# Altium project Carrier-Board-v1.0.PrjPcb (part 13 of 15)

## Sheet WIEGAND_INTERFACE.SchDoc
size A4; SheetNumber: 21; SheetTotal: 27
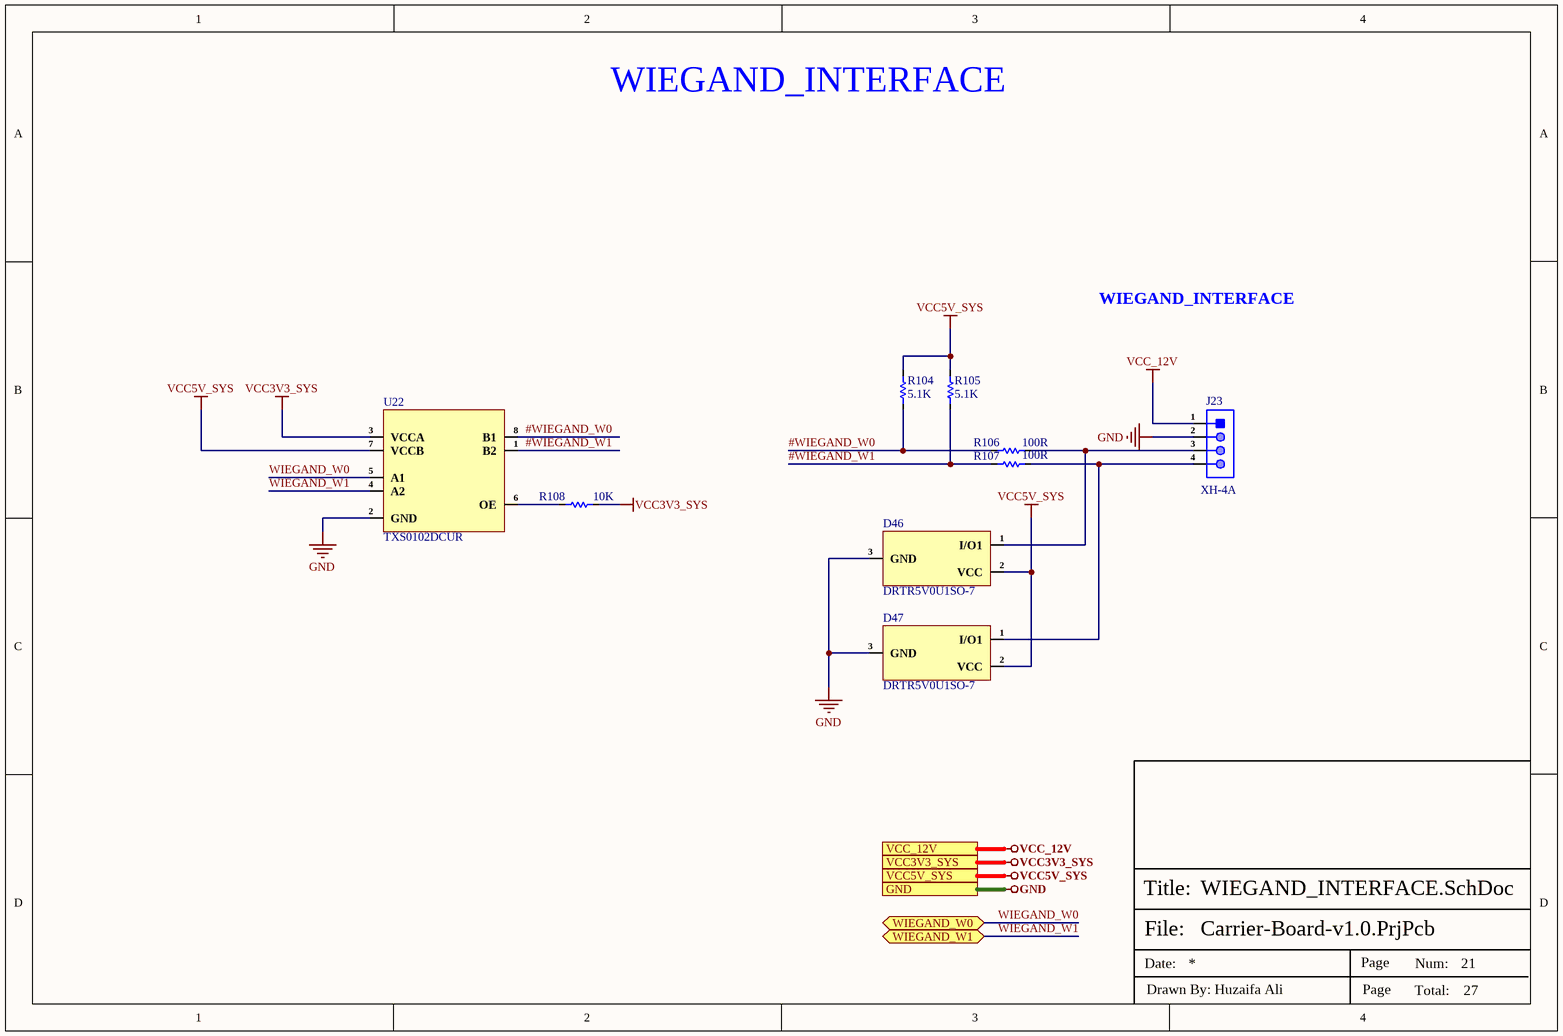
[diagram p20: WIEGAND_INTERFACE.SchDoc]

### Parts
D46  DRTR5V0U1SO-7  [SOT-23]
D47  DRTR5V0U1SO-7  [SOT-23]
J23  XH-4A  [XH-4A]
R104  5.1K  [Res-0402]
R105  5.1K  [Res-0402]
R106  100R  [Res-0402]
R107  100R  [Res-0402]
R108  10K  [Res-0402]
U22  TXS0102DCUR  [VSSOP-8(3.1x2.1)]

### Ports
GND (see TOP SHEET[3D], AUDIO_INTERFACE[1D], BUCK REGULATOR[3D], DEBUG_UART_INTERFACE[3D], DIGITAL IO_RELAY_SHEET[5D], DUAL_SIM_INTERFACE[3D], ETHERNET_PHY0[4D], ETHERNET_PHY1[4D], GSM_INTERFACE[2D], HDMI_INTERFACE[3D], INPUT_PROTECTION[3D], LINEAR_VOLTAGE_REG[3D], MICRO_SD_INTERFACE[3D], MIPI-DSI DISPLAY[3D], POWER SECTION[3D], PUSH BUTTONs_INTERFACE[3C], RGB_LEDs_INTERFACE[3D], ROCKCHIP_PWR_SUPPLY[1D], ROCKCHIP_SYSTEM_CONTROL[3C], RS232_RS485_INTERFACE[3C], SENSOR_SHEET[3D], USB2.0_INTERFACE[3D], USB3.0_INTERFACE[3D], USB-C_INTERFACE[2D], WIFI_BLUETOOTH_SHEET[4C]), VCC3V3_SYS (see TOP SHEET[3D], AUDIO_INTERFACE[1D], BUCK REGULATOR[3D], DEBUG_UART_INTERFACE[3D], DIGITAL IO_RELAY_SHEET[5D], ETHERNET_PHY0[4D], ETHERNET_PHY1[4D], GSM_INTERFACE[2D], HDMI_INTERFACE[3D], LINEAR_VOLTAGE_REG[3D], MIPI-DSI DISPLAY[3D], POWER SECTION[3D], PUSH BUTTONs_INTERFACE[3C], ROCKCHIP_PWR_SUPPLY[1D], ROCKCHIP_SYSTEM_CONTROL[3C], RS232_RS485_INTERFACE[3C], SENSOR_SHEET[3D], USB-C_INTERFACE[2D], WIFI_BLUETOOTH_SHEET[4C]), VCC5V_SYS (see TOP SHEET[3D], BUCK REGULATOR[3D], DIGITAL IO_RELAY_SHEET[5D], HDMI_INTERFACE[3D], LINEAR_VOLTAGE_REG[3D], MIPI-DSI DISPLAY[3D], POWER SECTION[3D], RGB_LEDs_INTERFACE[3D], ROCKCHIP_PWR_SUPPLY[1D], USB2.0_INTERFACE[3D], USB3.0_INTERFACE[3D], USB-C_INTERFACE[2D]), VCC_12V (see TOP SHEET[3D], AUDIO_INTERFACE[1D], BUCK REGULATOR[3D], INPUT_PROTECTION[3D], POWER SECTION[3D], PUSH BUTTONs_INTERFACE[3C]), WIEGAND_W0 (bidir, see TOP SHEET[3D], ROCKCHIP_GPIO_NC PINS[2D]), WIEGAND_W1 (bidir, see TOP SHEET[3D], ROCKCHIP_GPIO_NC PINS[2D])

### Nets
GND: D46.3(GND) D47.3(GND) J23.2 U22.2(GND) ; port GND
VCC3V3_SYS: R108.2 U22.3(VCCA) ; port VCC3V3_SYS
VCC5V_SYS: D46.2(VCC) D47.2(VCC) R104.2 R105.2 U22.7(VCCB) ; port VCC5V_SYS
VCC_12V: J23.1 ; port VCC_12V
#WIEGAND_W0: R104.1 R106.1 U22.8(B1)
#WIEGAND_W1: R105.1 R107.1 U22.1(B2)
WIEGAND_W0: U22.5(A1) ; port WIEGAND_W0
WIEGAND_W1: U22.4(A2) ; port WIEGAND_W1
NetD46_1: D46.1(I/O1) J23.3 R106.2
NetD47_1: D47.1(I/O1) J23.4 R107.2
NetR108_1: R108.1 U22.6(OE)

### Notes on the sheet
- WIEGAND_INTERFACE
- File:
- Title:
- Date:
- Page
- Num:
- Total:
- Drawn By: Huzaifa Ali

### Library data of the parts
D46 D47 = DRTR5V0U1SO-7: TVS DIODE 5.5VWM SOT23; Manufacturer: Diodes; Item Type: (TVS/ESD); Supplier: Digikey; Supplier Part Number: DRTR5V0U1SO-7DICT-ND; Manufacturer Part Number: DRTR5V0U1SO-7; RoHS: Yes; Category: TVS Diodes; Stock: 83982; Pricing: 1=0.34, 10=0.238, 100=0.1201, 500=0.098, 1000=0.07271 (USD); ComponentLink1URL: http://www.farnell.com/datasheets/2814436.pdf?src-supplier=Farnell; ComponentLink1Description: http://www.farnell.com/datasheets/2814436.pdf?src-supplier=Farnell; ComponentLink2URL: http://www.mouser.com/ds/2/115/DRTR5V0U1SO-271637.pdf?src-supplier=Mouser; ComponentLink2Description: http://www.mouser.com/ds/2/115/DRTR5V0U1SO-271637.pdf?src-supplier=Mouser; ComponentLink3URL: http://www.diodes.com/datasheets/DRTR5V0U1SO.pdf?src-supplier=Avnet; ComponentLink3Description: http://www.diodes.com/datasheets/DRTR5V0U1SO.pdf?src-supplier=Avnet; LCSC Part Number: C1973123
J23 = XH-4A: 1x4P 4P XH 1 Tin 2.5mm 4 -25℃~+85℃ Brass 3A Straight Plugin,P=2.5mm Wire To Board Connector ROHS; Manufacturer: HCTL; Manufacturer Part Number: XH-4A; Package: Plugin,P=2.5mm; LCSC Part Number: C2908602; Item Type: Wire To Board Connector; ComponentLink1Description: LCSC; ComponentLink1URL: https://www.lcsc.com/product-detail/Wire-To-Board-Connector_HCTL-XH-4A_C2908602.html
R104 R105 = RC0402FR-075K1L: RES 5.1K OHM 1% 1/16W 0402; Manufacturer: Yageo; Power Rating: 63mW; Resistance: 5.1kR; Temperature Coefficient: 100ppm/°C; Voltage Rating: 50V; Item Type: Resistor; Supplier 1: Avnet; Manufacturer Part Number: RC0402FR-075K1L; RoHS: Yes; Category: Chip SMD Resistors; Stock 1: 65000; Pricing 1: 10000=0.00085 (USD); Case/Package: 0402; Case Code (Metric): 1005; Case Code (Imperial): 0402; Min Operating Temperature: -55°C; Max Operating Temperature: 155°C; Tolerance: 1%; Technology: THICK FILM; Packaging: Tape and Reel; Package Quantity: 1; Resistor Type: Thick Film; Number of Terminations: 2; Termination: SMD/SMT; Max Power Dissipation: 63mW; Voltage Rating (DC): 50V; Working Voltage: 50V; Features: Moisture Resistant; Series: RC; Resistance Tolerance: 1%; Construction: Rectangular; Length: 1mm; Width: 0.02inch; Height: 0.016inch; Depth: 0.5mm; RoHS Compliant: Yes; Military Standard: Not; Lead Free: Lead Free; ComponentLink1URL: https://datasheet.ciiva.com/7983/1018594-7983519.pdf?src-supplier=Element14; ComponentLink1Description: https://datasheet.ciiva.com/7983/1018594-7983519.pdf?src-supplier=Element14; ComponentLink2URL: https://datasheet.ciiva.com/46394/1018594-46394936.pdf?src-supplier=Element14; ComponentLink2Description: https://datasheet.ciiva.com/46394/1018594-46394936.pdf?src-supplier=Element14; ComponentLink3URL: https://datasheet.ciiva.com/2453/pyu-r-int-thick-7-2453401.pdf?src-supplier=Digi-Key; ComponentLink3Description: https://datasheet.ciiva.com/2453/pyu-r-int-thick-7-2453401.pdf?src-supplier=Digi-Key; ComponentLink4URL: https://datasheet.ciiva.com/2453/pyu-r-int-thick-7-2453402.pdf?src-supplier=Digi-Key; ComponentLink4Description: https://datasheet.ciiva.com/2453/pyu-r-int-thick-7-2453402.pdf?src-supplier=Digi-Key; ComponentLink5URL: https://datasheet.ciiva.com/2453/pyu-r-int-thick-7-2453400.pdf?src-supplier=Digi-Key; ComponentLink5Description: https://datasheet.ciiva.com/2453/pyu-r-int-thick-7-2453400.pdf?src-supplier=Digi-Key; ComponentLink6URL: https://datasheet.ciiva.com/12558/pyu-rc0402-51-rohs-l-6-r-8721-12558460.pdf?src-supplier=Mouser; ComponentLink6Description: https://datasheet.ciiva.com/12558/pyu-rc0402-51-rohs-l-6-r-8721-12558460.pdf?src-supplier=Mouser; ComponentLink7URL: https://datasheet.ciiva.com/16744/pyu-rc0402-51-rohs-l-6-r-16744283.pdf?src-supplier=Future+Electronics; ComponentLink7Description: https://datasheet.ciiva.com/16744/pyu-rc0402-51-rohs-l-6-r-16744283.pdf?src-supplier=Future+Electronics; ComponentLink8URL: https://datasheet.ciiva.com/15189/getdatasheetpartid-323636-15189493.pdf?src-supplier=Verical; ComponentLink8Description: https://datasheet.ciiva.com/15189/getdatasheetpartid-323636-15189493.pdf?src-supplier=Verical; Supplier Part Number 1: RC0402FR-075K1L; LCSC Part Number: C105872
R106 R107 = RC0402FR-07100RL: RES 100 OHM 1% 1/16W 0402; Manufacturer: Yageo; Power Rating: 62.5mW; Voltage Rating: 50V; Temperature Coefficient: 100ppm/°C; Max Power Dissipation: 63mW; Item Type: Resistor; Supplier 1: Mouser; Manufacturer Part Number: RC0402FR-07100RL; RoHS: Yes; Category: Chip SMD Resistors; Stock 1: 699545; Pricing 1: 1=0.10000, 10=0.01200, 50=0.01200, 100=0.00500, 1000=0.00300, 2500=0.00200, 10000=0.00100 (USD); Case/Package: 0402; Number of Pins: 2; Case Code (Imperial): 0402; Case Code (Metric): 1005; Size Code: 0402; Min Operating Temperature: -55°C; Max Operating Temperature: 155°C; Tolerance: 1%; Voltage Rating (DC): 50V; Resistance: 100R; Packaging: Tape and Reel; Termination: SMD/SMT; Resistor Type: Thick Film; Features: Moisture Resistant; Series: RC; Number of Terminations: 2; Resistance Tolerance: 1%; Construction: Rectangular; Technology: THICK FILM; Length: 1mm; Width: 0.5mm; Height: 0.32mm; Depth: 0.5mm; RoHS Compliant: Yes; REACH SVHC: No SVHC; Military Standard: Not; Lead Free: Lead Free; ComponentLink1URL: https://datasheet.ciiva.com/11808/0900766b80c66297-11808765.pdf?src-supplier=RSComponents; ComponentLink1Description: https://datasheet.ciiva.com/11808/0900766b80c66297-11808765.pdf?src-supplier=RSComponents; ComponentLink2URL: https://datasheet.ciiva.com/7849/1784430-7849810.pdf?src-supplier=Element14; ComponentLink2Description: https://datasheet.ciiva.com/7849/1784430-7849810.pdf?src-supplier=Element14; ComponentLink3URL: https://datasheet.ciiva.com/28367/1018594-28367226.pdf?src-supplier=Element14; ComponentLink3Description: https://datasheet.ciiva.com/28367/1018594-28367226.pdf?src-supplier=Element14; ComponentLink4URL: https://datasheet.ciiva.com/22747/1018594-22747511.pdf?src-supplier=Element14; ComponentLink4Description: https://datasheet.ciiva.com/22747/1018594-22747511.pdf?src-supplier=Element14; ComponentLink5URL: https://datasheet.ciiva.com/12667/pyu-rc0402-51-rohs-l-6-r-12667957.pdf?src-supplier=Mouser; ComponentLink5Description: https://datasheet.ciiva.com/12667/pyu-rc0402-51-rohs-l-6-r-12667957.pdf?src-supplier=Mouser; ComponentLink6URL: https://datasheet.ciiva.com/15189/getdatasheetpartid-329466-15189335.pdf?src-supplier=Verical; ComponentLink6Description: https://datasheet.ciiva.com/15189/getdatasheetpartid-329466-15189335.pdf?src-supplier=Verical; ComponentLink7URL: https://datasheet.ciiva.com/16740/pyu-rc0402-51-rohs-l-6-r-16740566.pdf?src-supplier=Future+Electronics; ComponentLink7Description: https://datasheet.ciiva.com/16740/pyu-rc0402-51-rohs-l-6-r-16740566.pdf?src-supplier=Future+Electronics; Supplier Part Number 1: 603-RC0402FR-07100RL; LCSC Part Number: C106232
R108 = RC0402FR-0710KL: RES 10K OHM 1% 1/16W 0402; Manufacturer: Yageo; Resistance: 10kR; Voltage Rating (DC): 50V; Temperature Coefficient: 100ppm/°C; Power Rating: 62.5mW; Max Power Dissipation: 63mW; Item Type: Resistor; Supplier 1: Mouser; Manufacturer Part Number: RC0402FR-0710KL; RoHS: Yes; Category: Chip SMD Resistors; Stock 1: 18648329; Pricing 1: 1=0.10000, 10=0.01400, 50=0.01400, 100=0.00500, 1000=0.00300, 10000=0.00200 (USD); Case/Package: 0402; Number of Pins: 2; Case Code (Imperial): 0402; Case Code (Metric): 1005; Min Operating Temperature: -55°C; Max Operating Temperature: 155°C; Resistor Type: Thick Film; Tolerance: 1%; Packaging: Tape and Reel; Voltage Rating: 50V; Termination: SMD/SMT; Working Voltage: 50V; Number of Terminations: 2; Features: Moisture Resistant; Series: RC; Resistance Tolerance: 1%; Construction: Rectangular; Length: 1mm; Width: 0.5mm; Height: 0.32mm; Depth: 0.5mm; Lead Pitch: 0.2mm; REACH SVHC: No SVHC; Lead Free: Lead Free; RoHS Compliant: Yes; Military Standard: Not; ComponentLink1URL: https://datasheet.ciiva.com/7660/38568-7660787.pdf?src-supplier=Element14; ComponentLink1Description: https://datasheet.ciiva.com/7660/38568-7660787.pdf?src-supplier=Element14; ComponentLink2URL: https://datasheet.ciiva.com/7849/1686128-7849814.pdf?src-supplier=Element14; ComponentLink2Description: https://datasheet.ciiva.com/7849/1686128-7849814.pdf?src-supplier=Element14; ComponentLink3URL: https://datasheet.ciiva.com/7983/1018594-7983486.pdf?src-supplier=Element14; ComponentLink3Description: https://datasheet.ciiva.com/7983/1018594-7983486.pdf?src-supplier=Element14; ComponentLink4URL: https://datasheet.ciiva.com/22747/1018594-22747512.pdf?src-supplier=Element14; ComponentLink4Description: https://datasheet.ciiva.com/22747/1018594-22747512.pdf?src-supplier=Element14; ComponentLink5URL: https://datasheet.ciiva.com/12667/pyu-rc0402-51-rohs-l-6-r-12667067.pdf?src-supplier=Mouser; ComponentLink5Description: https://datasheet.ciiva.com/12667/pyu-rc0402-51-rohs-l-6-r-12667067.pdf?src-supplier=Mouser; ComponentLink6URL: https://datasheet.ciiva.com/7849/1784430-7849813.pdf?src-supplier=Element14; ComponentLink6Description: https://datasheet.ciiva.com/7849/1784430-7849813.pdf?src-supplier=Element14; ComponentLink7URL: https://datasheet.ciiva.com/7849/1784430-7849815.pdf?src-supplier=Element14; ComponentLink7Description: https://datasheet.ciiva.com/7849/1784430-7849815.pdf?src-supplier=Element14; Supplier Part Number 1: 603-RC0402FR-0710KL; LCSC Part Number: C60490
U22 = TXS0102DCUR: IC TRANSLTR BIDIRECTIONAL 8VSSOP; Manufacturer: Texas Instruments; Number of Outputs: 2NUMBER; Number of Inputs: 2; Nominal Supply Current: 14.4uA; Output Current: 1A; Min Supply Voltage: 1.65V; Max Supply Voltage: 5.5V; Data Rate: 24Mbps; Propagation Delay: 4.6ns; Logic Function: Translator; Turn-On Delay Time: 260ns; High Level Output Current: -20uA; Low Level Output Current: 1mA; Number of Circuits: 1; Supplier: Mouser; Supplier Part Number: 595-TXS0102DCUR; Manufacturer Part Number: TXS0102DCUR; RoHS: Yes; Category: Voltage Level Shifters; Stock: 149802; Pricing: 1=0.89, 10=0.739, 50=0.739, 100=0.561, 1000=0.383, 10000=0.313 (USD); Case/Package: VSSOP; Pins: 8; Weight: 0.000339oz; Min Operating Temperature: -40°C; Max Operating Temperature: 85°C; Package Quantity: 3000; Number of Channels: 2; Packaging: Tape and Reel; Number of Bits: 2; Quiescent Current: 14.4uA; Series: -; Channel Type: Bidirectional; Length: 2.3mm; Width: 2mm; Height: 900um; Thickness: 850um; Radiation Hardening: No; Reach SVHC Compliant: No; Lead Free: Lead Free; RoHS Compliant: Yes; ComponentLink1URL: https://datasheet.ciiva.com/22653/1846850-22653373.pdf?src-supplier=Farnell; ComponentLink1Description: https://datasheet.ciiva.com/22653/1846850-22653373.pdf?src-supplier=Farnell; ComponentLink2URL: https://datasheet.ciiva.com/15096/getdatasheetpartid-118249-15096172.pdf?src-supplier=Verical; ComponentLink2Description: https://datasheet.ciiva.com/15096/getdatasheetpartid-118249-15096172.pdf?src-supplier=Verical; ComponentLink3URL: https://datasheet.ciiva.com/1508/1857232-1508821.pdf?src-supplier=Element14; ComponentLink3Description: https://datasheet.ciiva.com/1508/1857232-1508821.pdf?src-supplier=Element14; ComponentLink4URL: https://datasheet.ciiva.com/28499/1863639-28499676.pdf?src-supplier=Element14; ComponentLink4Description: https://datasheet.ciiva.com/28499/1863639-28499676.pdf?src-supplier=Element14; ComponentLink5URL: https://datasheet.ciiva.com/46395/1863639-46395871.pdf?src-supplier=Element14; ComponentLink5Description: https://datasheet.ciiva.com/46395/1863639-46395871.pdf?src-supplier=Element14; ComponentLink6URL: https://datasheet.ciiva.com/1899/txs0102-1899369.pdf?src-supplier=Digikey; ComponentLink6Description: https://datasheet.ciiva.com/1899/txs0102-1899369.pdf?src-supplier=Digikey; ComponentLink7URL: https://datasheet.ciiva.com/1899/txs0102-1899368.pdf?src-supplier=Digikey; ComponentLink7Description: https://datasheet.ciiva.com/1899/txs0102-1899368.pdf?src-supplier=Digikey; ComponentLink8URL: https://datasheet.ciiva.com/1899/txs0102-1899370.pdf?src-supplier=Digikey; ComponentLink8Description: https://datasheet.ciiva.com/1899/txs0102-1899370.pdf?src-supplier=Digikey; ComponentLink9URL: https://datasheet.ciiva.com/14287/txs0102-14287516.pdf?src-supplier=Avnet; ComponentLink9Description: https://datasheet.ciiva.com/14287/txs0102-14287516.pdf?src-supplier=Avnet; ComponentLink10URL: https://datasheet.ciiva.com/14287/txs0102-14287518.pdf?src-supplier=Avnet; ComponentLink10Description: https://datasheet.ciiva.com/14287/txs0102-14287518.pdf?src-supplier=Avnet; LCSC Part Number: C53434; Item Type: IC

## Sheet SENSOR_SHEET.SchDoc
size A4; SheetNumber: 22; SheetTotal: 27
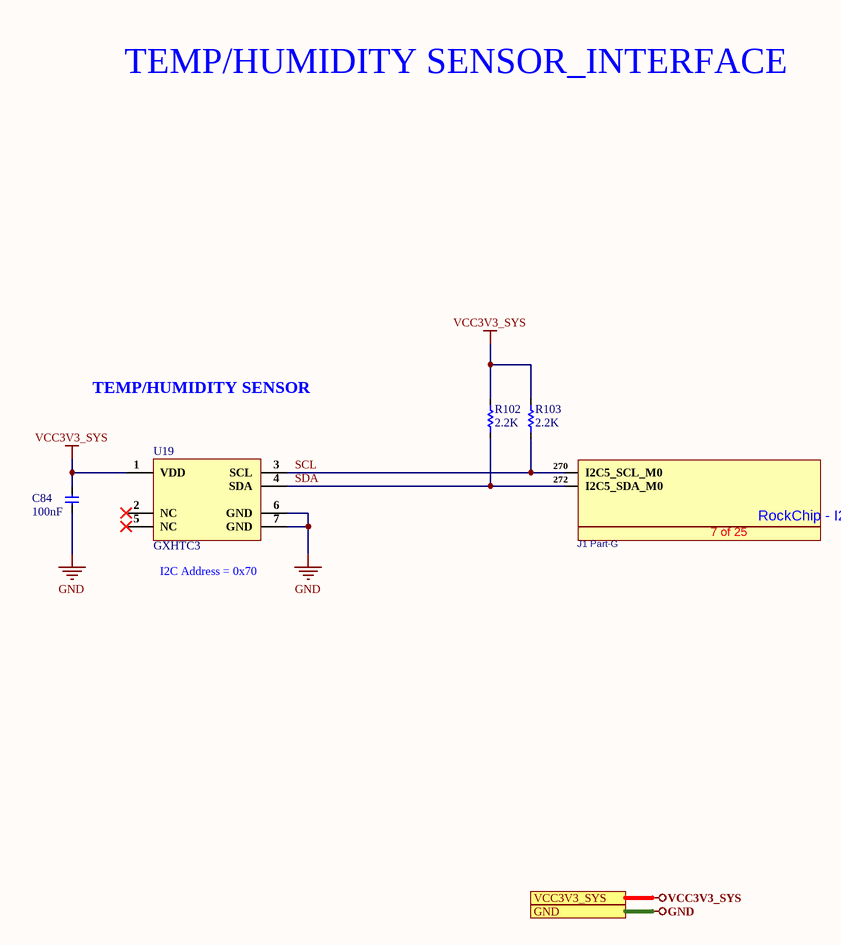
[diagram p21: SENSOR_SHEET.SchDoc]

### Parts
C84  100nF  [Cap-0402]
J1_Part-  AS0B826-S78B-7H  [AS0B826-S78B-7H]  (value not drawn)  (part G of 25)
R102  2.2K  [Res-0402]
R103  2.2K  [Res-0402]
U19  GXHTC3  [DFN-6-EP(2x2)]

### Ports
GND (see TOP SHEET[2D], AUDIO_INTERFACE[1D], BUCK REGULATOR[3D], DEBUG_UART_INTERFACE[3D], DIGITAL IO_RELAY_SHEET[5D], DUAL_SIM_INTERFACE[3D], ETHERNET_PHY0[4D], ETHERNET_PHY1[4D], GSM_INTERFACE[2D], HDMI_INTERFACE[3D], INPUT_PROTECTION[3D], LINEAR_VOLTAGE_REG[3D], MICRO_SD_INTERFACE[3D], MIPI-DSI DISPLAY[3D], POWER SECTION[3D], PUSH BUTTONs_INTERFACE[3C], RGB_LEDs_INTERFACE[3D], ROCKCHIP_PWR_SUPPLY[1D], ROCKCHIP_SYSTEM_CONTROL[3C], RS232_RS485_INTERFACE[3C], USB2.0_INTERFACE[3D], USB3.0_INTERFACE[3D], USB-C_INTERFACE[2D], WIEGAND_INTERFACE[3D], WIFI_BLUETOOTH_SHEET[4C]), VCC3V3_SYS (see TOP SHEET[2D], AUDIO_INTERFACE[1D], BUCK REGULATOR[3D], DEBUG_UART_INTERFACE[3D], DIGITAL IO_RELAY_SHEET[5D], ETHERNET_PHY0[4D], ETHERNET_PHY1[4D], GSM_INTERFACE[2D], HDMI_INTERFACE[3D], LINEAR_VOLTAGE_REG[3D], MIPI-DSI DISPLAY[3D], POWER SECTION[3D], PUSH BUTTONs_INTERFACE[3C], ROCKCHIP_PWR_SUPPLY[1D], ROCKCHIP_SYSTEM_CONTROL[3C], RS232_RS485_INTERFACE[3C], USB-C_INTERFACE[2D], WIEGAND_INTERFACE[3D], WIFI_BLUETOOTH_SHEET[4C])

### Nets
GND: C84.1 U19.6(GND) U19.7(GND) ; port GND
VCC3V3_SYS: C84.2 R102.2 R103.2 U19.1(VDD) ; port VCC3V3_SYS
SCL: J1_Part-.270(I2C5_SCL_M0) R103.1 U19.3(SCL)
SDA: J1_Part-.272(I2C5_SDA_M0) R102.1 U19.4(SDA)

Not connected (* = marked no-connect by the designer): U19 2(NC)* 5(NC)*

### Notes on the sheet
- TEMP/HUMIDITY SENSOR_INTERFACE
- TEMP/HUMIDITY SENSOR
- (near U19) I2C Address = 0x70
- File:
- Title:
- Date:
- Page
- Num:
- Total:
- Drawn By: Huzaifa Ali
- (in symbol AS0B826-S78B-7H, part G) RockChip - I2C5; 7 of 25

### Library data of the parts
C84 = CC0402KRX5R7BB104: CAP CER 0.1UF 16V X5R 0402; Manufacturer: Yageo; Tolerance: 10%; Manufacturer Part Number: CC0402KRX5R7BB104; RoHS: Yes; Category: Ceramic Capacitors; Supplier 1: Mouser; Stock 1: 936792; Pricing 1: 1=0.10000, 10=0.02300, 50=0.02300, 100=0.01100, 1000=0.00600, 10000=0.00400 (USD); Mount: Surface Mount; Case/Package: 0402; Number of Pins: 2; Case Code (Metric): 1005; Case Code (Imperial): 0402; Min Operating Temperature: -55°C; Max Operating Temperature: 85°C; Capacitance: 100nF; Dielectric: X5R; Packaging: Tape and Reel; Voltage Rating: 16V; Package Quantity: 1; Voltage Rating (DC): 16V; Termination: SMD/SMT; Resistor Type: Ceramic; Series: CC; Construction: Flat; Length: 1mm; Width: 0.02inch; Height: 0.5mm; Thickness: 0.022inch; Depth: 0.5mm; Radiation Hardening: No; REACH SVHC: Unknown; Lead Free: Lead Free; Halogen Free: Halogen Free; RoHS Compliant: Yes; ComponentLink1URL: https://datasheet.ciiva.com/155/mlccorderingcode-155879.pdf?src-supplier=Digi-Key; ComponentLink1Description: https://datasheet.ciiva.com/155/mlccorderingcode-155879.pdf?src-supplier=Digi-Key; ComponentLink2URL: https://datasheet.ciiva.com/155/mlccorderingcode-155878.pdf?src-supplier=Digi-Key; ComponentLink2Description: https://datasheet.ciiva.com/155/mlccorderingcode-155878.pdf?src-supplier=Digi-Key; ComponentLink3URL: https://datasheet.ciiva.com/155/mlccorderingcode-155880.pdf?src-supplier=Digi-Key; ComponentLink3Description: https://datasheet.ciiva.com/155/mlccorderingcode-155880.pdf?src-supplier=Digi-Key; ComponentLink4URL: https://datasheet.ciiva.com/11464/upy-gphc-x5r-4v-to-50v-12-11464869.pdf?src-supplier=Avnet; ComponentLink4Description: https://datasheet.ciiva.com/11464/upy-gphc-x5r-4v-to-50v-12-11464869.pdf?src-supplier=Avnet; Supplier Part Number 1: 603-CC402KRX5R7BB104; LCSC Part Number: C106204
J1_Part- = AS0B826-S78B-7H: SMD,P=0.5mm,Surface Mount，Right Angle; Manufacturer: FOXCONN; Item Type: Card Edge Connectors; Supplier: LCSC; Manufacturer Part Number: AS0B826-S78B-7H; RoHS: No; Stock: 4979; Pricing: 1=9.21, 10=8.287, 25=7.8064, 50=7.6064, 100=7.4062 (USD); LCSC Part Number: C426232
R102 R103 = RC0402FR-072K2L: RES SMD 2.2K OHM 1% 1/16W 0402; Manufacturer: Yageo; Power Rating: 63mW; Resistance: 2.2kR; Voltage Rating: 50V; Temperature Coefficient: 100ppm/°C; Supplier 1: Digi-Key; Manufacturer Part Number: RC0402FR-072K2L; Stock 1: 966157; Pricing 1: 1=0.1, 10=0.016, 100=0.0066, 1000=0.00299, 2500=0.00259, 5000=0.00214 (USD); Case/Package: 0402; Case Code (Imperial): 0402; Case Code (Metric): 1005; Size Code: 0402; Min Operating Temperature: -55°C; Max Operating Temperature: 155°C; Tolerance: 1%; Packaging: Tape and Reel; Resistor Type: Thick Film; Termination: SMD/SMT; Features: Moisture Resistant; Series: RC; Max Power Dissipation: 63mW; Number of Terminations: 2; Resistance Tolerance: 1%; Construction: Rectangular; Length: 1mm; Width: 0.5mm; Height: 0.35mm; Depth: 0.5mm; RoHS Compliant: Yes; Military Standard: Not; Lead Free: Lead Free; ComponentLink1URL: http://www.farnell.com/datasheets/2167052.pdf?src-supplier=Element14; ComponentLink1Description: http://www.farnell.com/datasheets/2167052.pdf?src-supplier=Element14; ComponentLink2URL: http://www.yageo.com/documents/recent/PYu-RC_Group_51_RoHS_L_9.pdf?src-supplier=Mouser; ComponentLink2Description: http://www.yageo.com/documents/recent/PYu-RC_Group_51_RoHS_L_9.pdf?src-supplier=Mouser; ComponentLink3URL: http://documents.rs-components.com/techlib://itc_doclist_GB.htm?stockno=6186532&src-supplier=RSComponents; ComponentLink3Description: http://documents.rs-components.com/techlib://itc_doclist_GB.htm?stockno=6186532&src-supplier=RSComponents; ComponentLink4URL: http://www.yageo.com/documents/recent/PYu-RC0402_51_RoHS_L_6_r.pdf?src-supplier=Future+Electronics; ComponentLink4Description: http://www.yageo.com/documents/recent/PYu-RC0402_51_RoHS_L_6_r.pdf?src-supplier=Future+Electronics; Supplier Part Number 1: 311-2.20KLRCT-ND; LCSC Part Number: C114762; Weight: 2.3E-05oz; Technology: THICK FILM; REACH SVHC: Unknown
U19 = GXHTC3: DFN-6-EP(2x2) Temperature and Humidity Sensor ROHS; Manufacturer: GXCAS; Item Type: Temperature & Humidity Sensor; Manufacturer Part Number: GXHTC3; Package: DFN-6-EP(2x2); LCSC Part Number: C2837688; ComponentLink1Description: LCSC; ComponentLink1URL: https://www.lcsc.com/product-detail/Temperature-and-Humidity-Sensor_GXCAS-GXHTC3_C2837688.html

## Sheet ROCKCHIP_SYSTEM_CONTROL.SchDoc
size A4; SheetNumber: 27; SheetTotal: 27
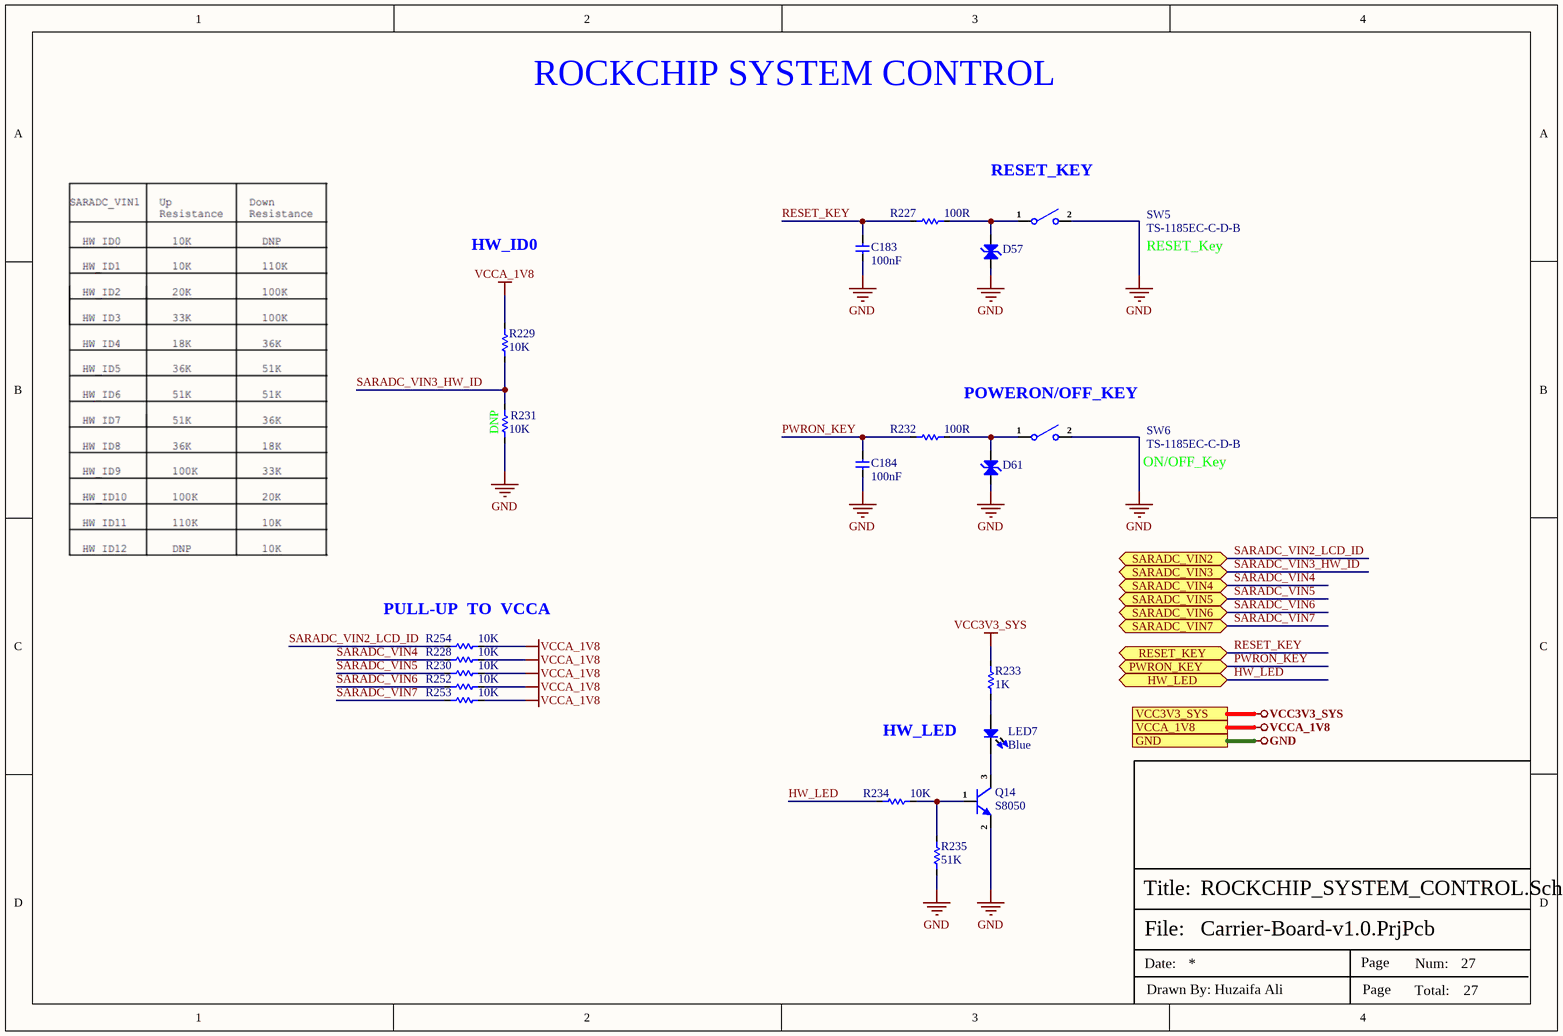
[diagram p22: ROCKCHIP_SYSTEM_CONTROL.SchDoc]

### Parts
C183  100nF  [Cap-0402]
C184  100nF  [Cap-0402]
D57  ESD5451N  [DFN1006-2L (Bi-Directional)]  (value not drawn)
D61  ESD5451N  [DFN1006-2L (Bi-Directional)]  (value not drawn)
LED7  Blue  [LED-0402]
Q14  S8050  [SOT-23]
R227  100R  [Res-0402]
R228  10K  [Res-0402]
R229  10K  [Res-0402]
R230  10K  [Res-0402]
R231  DNP  [Res-0402]
R232  100R  [Res-0402]
R233  1K  [Res-0603]
R234  10K  [Res-0402]
R235  51K  [Res-0402]
R252  10K  [Res-0402]
R253  10K  [Res-0402]
R254  10K  [Res-0402]
SW5  TS-1185EC-C-D-B  [TS-1185EC-C-D-B_]
SW6  TS-1185EC-C-D-B  [TS-1185EC-C-D-B_]

### Ports
GND (see TOP SHEET[4C], AUDIO_INTERFACE[1D], BUCK REGULATOR[3D], DEBUG_UART_INTERFACE[3D], DIGITAL IO_RELAY_SHEET[5D], DUAL_SIM_INTERFACE[3D], ETHERNET_PHY0[4D], ETHERNET_PHY1[4D], GSM_INTERFACE[2D], HDMI_INTERFACE[3D], INPUT_PROTECTION[3D], LINEAR_VOLTAGE_REG[3D], MICRO_SD_INTERFACE[3D], MIPI-DSI DISPLAY[3D], POWER SECTION[3D], PUSH BUTTONs_INTERFACE[3C], RGB_LEDs_INTERFACE[3D], ROCKCHIP_PWR_SUPPLY[1D], RS232_RS485_INTERFACE[3C], SENSOR_SHEET[3D], USB2.0_INTERFACE[3D], USB3.0_INTERFACE[3D], USB-C_INTERFACE[2D], WIEGAND_INTERFACE[3D], WIFI_BLUETOOTH_SHEET[4C]), HW_LED (bidir, see TOP SHEET[5C], ROCKCHIP_GPIO_NC PINS[3D]), PWRON_KEY (bidir, see TOP SHEET[5C], ROCKCHIP_GPIO_NC PINS[3D]), RESET_KEY (bidir, see TOP SHEET[5C], ROCKCHIP_GPIO_NC PINS[3D]), SARADC_VIN2 (bidir, see TOP SHEET[5C], MIPI-DSI DISPLAY[3D], ROCKCHIP_GPIO_NC PINS[3C]), SARADC_VIN3 (bidir, see TOP SHEET[5C], ROCKCHIP_GPIO_NC PINS[3C]), SARADC_VIN4 (bidir, see TOP SHEET[5C], ROCKCHIP_GPIO_NC PINS[3D]), SARADC_VIN5 (bidir, see TOP SHEET[5C], ROCKCHIP_GPIO_NC PINS[3D]), SARADC_VIN6 (bidir, see TOP SHEET[5C], ROCKCHIP_GPIO_NC PINS[3D]), SARADC_VIN7 (bidir, see TOP SHEET[5C], ROCKCHIP_GPIO_NC PINS[3D]), VCC3V3_SYS (see TOP SHEET[4C], AUDIO_INTERFACE[1D], BUCK REGULATOR[3D], DEBUG_UART_INTERFACE[3D], DIGITAL IO_RELAY_SHEET[5D], ETHERNET_PHY0[4D], ETHERNET_PHY1[4D], GSM_INTERFACE[2D], HDMI_INTERFACE[3D], LINEAR_VOLTAGE_REG[3D], MIPI-DSI DISPLAY[3D], POWER SECTION[3D], PUSH BUTTONs_INTERFACE[3C], ROCKCHIP_PWR_SUPPLY[1D], RS232_RS485_INTERFACE[3C], SENSOR_SHEET[3D], USB-C_INTERFACE[2D], WIEGAND_INTERFACE[3D], WIFI_BLUETOOTH_SHEET[4C]), VCCA_1V8 (see TOP SHEET[4C], PUSH BUTTONs_INTERFACE[3C], ROCKCHIP_PWR_SUPPLY[1D])

### Nets
GND: C183.1 C184.1 D57.1(K) D61.1(K) Q14.2(E) R231.2 R235.1 SW5.2 SW6.2 ; port GND
VCC3V3_SYS: R233.2 ; port VCC3V3_SYS
VCCA_1V8: R228.1 R229.1 R230.1 R252.1 R253.1 R254.1 ; port VCCA_1V8
HW_LED: R234.1 ; port HW_LED
PWRON_KEY: C184.2 R232.1 ; port PWRON_KEY
RESET_KEY: C183.2 R227.1 ; port RESET_KEY
SARADC_VIN2_LCD_ID: R254.2 ; port SARADC_VIN2  [project net SARADC_VIN2]
SARADC_VIN3_HW_ID: R229.2 R231.1 ; port SARADC_VIN3
SARADC_VIN4: R228.2 ; port SARADC_VIN4
SARADC_VIN5: R230.2 ; port SARADC_VIN5
SARADC_VIN6: R252.2 ; port SARADC_VIN6
SARADC_VIN7: R253.2 ; port SARADC_VIN7
NetD57_2: D57.2(K) R227.2 SW5.1
NetD61_2: D61.2(K) R232.2 SW6.1
NetLED7_1: LED7.1 R233.1
NetLED7_2: LED7.2 Q14.3(C)
NetQ14_1: Q14.1(B) R234.2 R235.2

### Notes on the sheet
- ROCKCHIP SYSTEM CONTROL
- RESET_KEY
- HW_ID0
- RESET_Key
- (near R231) 10K
- POWERON/OFF_KEY
- ON/OFF_Key
- PULL-UP  TO  VCCA
- HW_LED
- File:
- Title:
- Date:
- Page
- Num:
- Total:
- Drawn By: Huzaifa Ali

### Library data of the parts
C183 C184 = CC0402KRX5R7BB104: as C84 on sheet SENSOR_SHEET; Manufacturer Part Number: CC0402KRX5R7BB104; RoHS: Yes; Category: Ceramic Capacitors; Supplier 1: Mouser; Stock 1: 936792; Pricing 1: 1=0.10000, 10=0.02300, 50=0.02300, 100=0.01100, 1000=0.00600, 10000=0.00400 (USD); Mount: Surface Mount; Case/Package: 0402; Number of Pins: 2; Case Code (Metric): 1005; Case Code (Imperial): 0402; Min Operating Temperature: -55°C; Max Operating Temperature: 85°C; Capacitance: 100nF; Dielectric: X5R; Packaging: Tape and Reel; Voltage Rating: 16V; Package Quantity: 1; Voltage Rating (DC): 16V; Termination: SMD/SMT; Resistor Type: Ceramic; Series: CC; Construction: Flat; Length: 1mm; Width: 0.02inch; Height: 0.5mm; Thickness: 0.022inch; Depth: 0.5mm; Radiation Hardening: No; REACH SVHC: Unknown; Lead Free: Lead Free; Halogen Free: Halogen Free; RoHS Compliant: Yes; ComponentLink1URL: https://datasheet.ciiva.com/155/mlccorderingcode-155879.pdf?src-supplier=Digi-Key; ComponentLink1Description: https://datasheet.ciiva.com/155/mlccorderingcode-155879.pdf?src-supplier=Digi-Key; ComponentLink2URL: https://datasheet.ciiva.com/155/mlccorderingcode-155878.pdf?src-supplier=Digi-Key; ComponentLink2Description: https://datasheet.ciiva.com/155/mlccorderingcode-155878.pdf?src-supplier=Digi-Key; ComponentLink3URL: https://datasheet.ciiva.com/155/mlccorderingcode-155880.pdf?src-supplier=Digi-Key; ComponentLink3Description: https://datasheet.ciiva.com/155/mlccorderingcode-155880.pdf?src-supplier=Digi-Key; ComponentLink4URL: https://datasheet.ciiva.com/11464/upy-gphc-x5r-4v-to-50v-12-11464869.pdf?src-supplier=Avnet; ComponentLink4Description: https://datasheet.ciiva.com/11464/upy-gphc-x5r-4v-to-50v-12-11464869.pdf?src-supplier=Avnet; Supplier Part Number 1: 603-CC402KRX5R7BB104; LCSC Part Number: C106204
D57 D61 = ESD5451N: DFN1006-2(0402) ESD Protection Devices ROHS; Manufacturer: TECH PUBLIC; Manufacturer Part Number: ESD5451N; Footprint: DFN1006-2(0402); ComponentLink1Description: LCSC; ComponentLink1URL: https://www.lcsc.com/product-detail/span-style-background-color-ff0-ESD-span-Protection-Devices_TECH-PUBLIC-ESD5451N_C2936977.html; LCSC Part Number: C2936977
LED7 = XZCBD68W-2: LED BLUE CLEAR 2SMD; Manufacturer: SunLED; Lens Color: Colorless; Luminous Intensity: 59mcd; Test Current: 20mA; Viewing Angle: 120°; Dominant Wavelength: 465nm; Forward Voltage: 3.3V; Supplier 1: Digi-Key; Manufacturer Part Number: XZCBD68W-2; RoHS: Yes; Category: LEDs; Stock 1: 9545; Pricing 1: 1=0.52000, 10=0.31700, 100=0.18240, 1000=0.14276 (USD); Mount: Surface Mount; Case/Package: 0402; Color: Blue; Packaging: Tape and Reel; Lens Transparency: Clear; Length: 1mm; Width: 0.5mm; Height: 0.5mm; RoHS Compliant: Yes; ComponentLink1URL: http://www.sunledusa.com/products/spec/XZCBD68W-2.pdf?src-supplier=Digi-Key; ComponentLink1Description: http://www.sunledusa.com/products/spec/XZCBD68W-2.pdf?src-supplier=Digi-Key; ComponentLink2URL: https://www.sunledusa.com/products/spec/XZCBD68W-2.pdf?src-supplier=Digi-Key; ComponentLink2Description: https://www.sunledusa.com/products/spec/XZCBD68W-2.pdf?src-supplier=Digi-Key; Supplier Part Number 1: 1497-1392-1-ND; Item Type: LED
Q14 = S8050: Trans Gp Bjt NPN 25V 1.5A 300MW 3-PIN SOT-23 T/r; Manufacturer: Comchip; Manufacturer Part Number: SS8050-G; Collector Emitter Voltage (VCEO): 400mV; Transition Frequency: 100MHz; Item Type: Transistor; Supplier 1: Arrow Electronics; RoHS: Yes; Stock 1: 2514; Pricing 1: 1=0.26480, 10=0.19960, 25=0.19760, 50=0.19590, 100=0.09990, 250=0.09890, 500=0.07670, 1000=0.05180 (USD); Mount: Surface Mount; Case/Package: TO-236-3; Packaging: Tape and Reel; Max Power Dissipation: 300mW; Max Collector Current: 1.5A; Collector Emitter Breakdown Voltage: 25V; Max Breakdown Voltage: 25V; ComponentLink1URL: http://www.comchiptech.com/admin/files/product/SS8050-G RevA181526.pdf?src-supplier=Digi-Key; ComponentLink1Description: http://www.comchiptech.com/admin/files/product/SS8050-G RevA181526.pdf?src-supplier=Digi-Key; ComponentLink2URL: http://www.comchiptech.com/cms/UserFiles/SS8050-G%20RevA181526.pdf?src-supplier=Digi-Key; ComponentLink2Description: http://www.comchiptech.com/cms/UserFiles/SS8050-G%20RevA181526.pdf?src-supplier=Digi-Key; Supplier Part Number 1: SS8050-G; LCSC Part Number: C105433
R227 R232 = RC0402FR-07100RL: as R106 on sheet WIEGAND_INTERFACE; Supplier 1: Mouser; Manufacturer Part Number: RC0402FR-07100RL; RoHS: Yes; Category: Chip SMD Resistors; Stock 1: 699545; Pricing 1: 1=0.10000, 10=0.01200, 50=0.01200, 100=0.00500, 1000=0.00300, 2500=0.00200, 10000=0.00100 (USD); Case/Package: 0402; Number of Pins: 2; Case Code (Imperial): 0402; Case Code (Metric): 1005; Size Code: 0402; Min Operating Temperature: -55°C; Max Operating Temperature: 155°C; Tolerance: 1%; Voltage Rating (DC): 50V; Resistance: 100R; Packaging: Tape and Reel; Termination: SMD/SMT; Resistor Type: Thick Film; Features: Moisture Resistant; Series: RC; Number of Terminations: 2; Resistance Tolerance: 1%; Construction: Rectangular; Technology: THICK FILM; Length: 1mm; Width: 0.5mm; Height: 0.32mm; Depth: 0.5mm; RoHS Compliant: Yes; REACH SVHC: No SVHC; Military Standard: Not; Lead Free: Lead Free; ComponentLink1URL: https://datasheet.ciiva.com/11808/0900766b80c66297-11808765.pdf?src-supplier=RSComponents; ComponentLink1Description: https://datasheet.ciiva.com/11808/0900766b80c66297-11808765.pdf?src-supplier=RSComponents; ComponentLink2URL: https://datasheet.ciiva.com/7849/1784430-7849810.pdf?src-supplier=Element14; ComponentLink2Description: https://datasheet.ciiva.com/7849/1784430-7849810.pdf?src-supplier=Element14; ComponentLink3URL: https://datasheet.ciiva.com/28367/1018594-28367226.pdf?src-supplier=Element14; ComponentLink3Description: https://datasheet.ciiva.com/28367/1018594-28367226.pdf?src-supplier=Element14; ComponentLink4URL: https://datasheet.ciiva.com/22747/1018594-22747511.pdf?src-supplier=Element14; ComponentLink4Description: https://datasheet.ciiva.com/22747/1018594-22747511.pdf?src-supplier=Element14; ComponentLink5URL: https://datasheet.ciiva.com/12667/pyu-rc0402-51-rohs-l-6-r-12667957.pdf?src-supplier=Mouser; ComponentLink5Description: https://datasheet.ciiva.com/12667/pyu-rc0402-51-rohs-l-6-r-12667957.pdf?src-supplier=Mouser; ComponentLink6URL: https://datasheet.ciiva.com/15189/getdatasheetpartid-329466-15189335.pdf?src-supplier=Verical; ComponentLink6Description: https://datasheet.ciiva.com/15189/getdatasheetpartid-329466-15189335.pdf?src-supplier=Verical; ComponentLink7URL: https://datasheet.ciiva.com/16740/pyu-rc0402-51-rohs-l-6-r-16740566.pdf?src-supplier=Future+Electronics; ComponentLink7Description: https://datasheet.ciiva.com/16740/pyu-rc0402-51-rohs-l-6-r-16740566.pdf?src-supplier=Future+Electronics; Supplier Part Number 1: 603-RC0402FR-07100RL; LCSC Part Number: C106232
R228-R231 R234 R252-R254 = RC0402FR-0710KL: RES 10K OHM 1% 1/16W 0402; Manufacturer: Yageo; Max Power Dissipation: 63mW; Temperature Coefficient: 100ppm/°C; Resistance: 10kR; Voltage Rating (DC): 50V; Power Rating: 62.5mW; Item Type: Resistor; Manufacturer Part Number: RC0402FR-0710KL; RoHS: Yes; Category: Chip SMD Resistors; Case/Package: 0402; Case Code (Imperial): 0402; Case Code (Metric): 1005; Min Operating Temperature: -55°C; Max Operating Temperature: 155°C; Features: Moisture Resistant; Packaging: Tape and Reel; Tolerance: 1%; Number of Terminations: 2; Series: RC; RoHS Compliant: Yes; ComponentLink1URL: https://datasheet.ciiva.com/7660/38568-7660787.pdf?src-supplier=Element14; ComponentLink1Description: https://datasheet.ciiva.com/7660/38568-7660787.pdf?src-supplier=Element14; Supplier 1: Mouser; Stock 1: 18648329; Pricing 1: 1=0.10000, 10=0.01400, 50=0.01400, 100=0.00500, 1000=0.00300, 10000=0.00200 (USD); Number of Pins: 2; Resistor Type: Thick Film; Voltage Rating: 50V; Termination: SMD/SMT; Resistance Tolerance: 1%; Construction: Rectangular; Length: 1mm; Width: 0.5mm; Height: 0.32mm; Depth: 0.5mm; Lead Pitch: 0.2mm; REACH SVHC: No SVHC; Lead Free: Lead Free; Military Standard: Not; ComponentLink2URL: https://datasheet.ciiva.com/7849/1686128-7849814.pdf?src-supplier=Element14; ComponentLink2Description: https://datasheet.ciiva.com/7849/1686128-7849814.pdf?src-supplier=Element14; ComponentLink3URL: https://datasheet.ciiva.com/7983/1018594-7983486.pdf?src-supplier=Element14; ComponentLink3Description: https://datasheet.ciiva.com/7983/1018594-7983486.pdf?src-supplier=Element14; ComponentLink4URL: https://datasheet.ciiva.com/22747/1018594-22747512.pdf?src-supplier=Element14; ComponentLink4Description: https://datasheet.ciiva.com/22747/1018594-22747512.pdf?src-supplier=Element14; ComponentLink5URL: https://datasheet.ciiva.com/12667/pyu-rc0402-51-rohs-l-6-r-12667067.pdf?src-supplier=Mouser; ComponentLink5Description: https://datasheet.ciiva.com/12667/pyu-rc0402-51-rohs-l-6-r-12667067.pdf?src-supplier=Mouser; ComponentLink6URL: https://datasheet.ciiva.com/7849/1784430-7849813.pdf?src-supplier=Element14; ComponentLink6Description: https://datasheet.ciiva.com/7849/1784430-7849813.pdf?src-supplier=Element14; Supplier Part Number 1: 603-RC0402FR-0710KL; LCSC Part Number: C60490; Working Voltage: 50V; ComponentLink7URL: https://datasheet.ciiva.com/7849/1784430-7849815.pdf?src-supplier=Element14; ComponentLink7Description: https://datasheet.ciiva.com/7849/1784430-7849815.pdf?src-supplier=Element14
R233 = CRCW06031K00FKEA: RES SMD 1K OHM 1% 1/10W 0603; Manufacturer: Vishay Dale; Item Type: Resistor; Value: 1kR; Voltage Rating: 75V; Temperature Coefficient: 100ppm/°C; Power Rating: 100mW; LCSC Part Number: C844920; ComponentLink2URL: https://datasheet.ciiva.com/11808/0900766b80d98afc-11808625.pdf?src-supplier=Rs; ComponentLink2Description: https://datasheet.ciiva.com/11808/0900766b80d98afc-11808625.pdf?src-supplier=Rs; ComponentLink3URL: https://datasheet.ciiva.com/46441/1720486-46441623.pdf?src-supplier=Element14; ComponentLink3Description: https://datasheet.ciiva.com/46441/1720486-46441623.pdf?src-supplier=Element14; ComponentLink4URL: https://datasheet.ciiva.com/46441/1720486-46441622.pdf?src-supplier=Element14; ComponentLink4Description: https://datasheet.ciiva.com/46441/1720486-46441622.pdf?src-supplier=Element14; ComponentLink5URL: https://datasheet.ciiva.com/26316/fld-crcw-e3-data-en-26316551.pdf?src-supplier=Distrelec; ComponentLink5Description: https://datasheet.ciiva.com/26316/fld-crcw-e3-data-en-26316551.pdf?src-supplier=Distrelec; ComponentLink6URL: https://datasheet.ciiva.com/2465/dcrcwe3-2465536.pdf?src-supplier=Digi-Key; ComponentLink6Description: https://datasheet.ciiva.com/2465/dcrcwe3-2465536.pdf?src-supplier=Digi-Key; ComponentLink7URL: https://datasheet.ciiva.com/2465/dcrcwe3-2465534.pdf?src-supplier=Digi-Key; ComponentLink7Description: https://datasheet.ciiva.com/2465/dcrcwe3-2465534.pdf?src-supplier=Digi-Key; ComponentLink8URL: https://datasheet.ciiva.com/16199/dcrcwe3-16199053.pdf?src-supplier=Future+Electronics; ComponentLink8Description: https://datasheet.ciiva.com/16199/dcrcwe3-16199053.pdf?src-supplier=Future+Electronics; ComponentLink9URL: https://datasheet.ciiva.com/46385/1697337-46385497.pdf?src-supplier=Element14; ComponentLink9Description: https://datasheet.ciiva.com/46385/1697337-46385497.pdf?src-supplier=Element14; ComponentLink10URL: https://datasheet.ciiva.com/2465/dcrcwe3-2465535.pdf?src-supplier=Digi-Key; ComponentLink10Description: https://datasheet.ciiva.com/2465/dcrcwe3-2465535.pdf?src-supplier=Digi-Key; ComponentLink11URL: https://datasheet.ciiva.com/8336/dcrcwe3-8336822.pdf?src-supplier=Avnet; ComponentLink11Description: https://datasheet.ciiva.com/8336/dcrcwe3-8336822.pdf?src-supplier=Avnet; ComponentLink12URL: https://datasheet.ciiva.com/3257/dcrcwe3-3257132.pdf?src-supplier=Avnet; ComponentLink12Description: https://datasheet.ciiva.com/3257/dcrcwe3-3257132.pdf?src-supplier=Avnet; Supplier: Mouser; Supplier Part Number: 71-CRCW0603-1.0K-E3; Manufacturer Part Number: CRCW06031K00FKEA; RoHS: Yes; Category: Chip SMD Resistors; Stock: 1295653; Pricing: 1=0.1, 10=0.017, 50=0.017, 100=0.01, 1000=0.008, 10000=0.004 (USD); Case/Package: 0603; Pins: 2; Contact Plating: Tin; Weight: 7.1E-05oz; Case Code (Metric): 1608; Case Code (Imperial): 0603; Min Operating Temperature: -55°C; Max Operating Temperature: 155°C; Tolerance: 1%; Resistor Type: Thick Film; Packaging: Tape and Reel; Package Quantity: 5000; Number of Terminations: 2; Termination: SMD/SMT; Max Power Dissipation: 100mW; Features: Automotive AEC-Q200; Series: CRCW; Technology: THICK FILM; Resistance Tolerance: 1%; Voltage Rating (DC): 75V; Construction: Rectangular; Length: 1.55mm; Width: 0.85mm; Height: 0.45mm; Depth: 0.85mm; Ratings: AEC-Q200; Radiation Hardening: No; RoHS Compliant: Yes; Reach SVHC Compliant: Unknown; Lead Free: 5697LeadFree; Military Standard: Not; ComponentLink1URL: https://datasheet.ciiva.com/11808/0900766b80d98afc-11808625.pdf?src-supplier=Rs; ComponentLink1Description: https://datasheet.ciiva.com/11808/0900766b80d98afc-11808625.pdf?src-supplier=Rs; ComponentLink13URL: https://datasheet.ciiva.com/2465/dcrcwe3-2465535.pdf?src-supplier=Digikey; ComponentLink13Description: https://datasheet.ciiva.com/2465/dcrcwe3-2465535.pdf?src-supplier=Digikey; ComponentLink14URL: https://datasheet.ciiva.com/2465/dcrcwe3-2465536.pdf?src-supplier=Digikey; ComponentLink14Description: https://datasheet.ciiva.com/2465/dcrcwe3-2465536.pdf?src-supplier=Digikey; ComponentLink15URL: https://datasheet.ciiva.com/2465/dcrcwe3-2465534.pdf?src-supplier=Digikey; ComponentLink15Description: https://datasheet.ciiva.com/2465/dcrcwe3-2465534.pdf?src-supplier=Digikey
R235 = RC0402FR-0751KL: RES 51K OHM 1% 1/16W 0402; Manufacturer: Yageo; Power Rating: 63mW; Temperature Coefficient: 100ppm/°C; Value: 51kR; Voltage Rating: 50V; Item Type: Resistor; Supplier 1: Future Electronics; Manufacturer Part Number: RC0402FR-0751KL; RoHS: Yes; Category: Chip SMD Resistors; Stock 1: 610000; Pricing 1: 10000=0.00100, 50000=0.00100, 300000=0.00090, 1000000=0.00090, 3000000=0.00080 (USD); Case/Package: 0402; Case Code (Imperial): 0402; Case Code (Metric): 1005; Min Operating Temperature: -55°C; Max Operating Temperature: 155°C; Tolerance: 1%; Technology: THICK FILM; Packaging: Cut Tape; Package Quantity: 1; Termination: SMD/SMT; Resistor Type: Thick Film; Number of Terminations: 2; Max Power Dissipation: 63mW; Voltage Rating (DC): 50V; Working Voltage: 50V; Features: Moisture Resistant; Series: RC; Resistance Tolerance: 1%; Construction: Rectangular; Length: 0.039inch; Width: 0.02inch; Height: 0.016inch; Depth: 0.5mm; RoHS Compliant: Yes; Military Standard: Not; Lead Free: Lead Free; ComponentLink1URL: https://datasheet.ciiva.com/7850/1018594-7850037.pdf?src-supplier=Element14; ComponentLink1Description: https://datasheet.ciiva.com/7850/1018594-7850037.pdf?src-supplier=Element14; ComponentLink2URL: https://datasheet.ciiva.com/2519/pyu-r-int-thick-7-2519211.pdf?src-supplier=Digi-Key; ComponentLink2Description: https://datasheet.ciiva.com/2519/pyu-r-int-thick-7-2519211.pdf?src-supplier=Digi-Key; ComponentLink3URL: https://datasheet.ciiva.com/2519/pyu-r-int-thick-7-2519212.pdf?src-supplier=Digi-Key; ComponentLink3Description: https://datasheet.ciiva.com/2519/pyu-r-int-thick-7-2519212.pdf?src-supplier=Digi-Key; ComponentLink4URL: https://datasheet.ciiva.com/2519/pyu-r-int-thick-7-2519210.pdf?src-supplier=Digi-Key; ComponentLink4Description: https://datasheet.ciiva.com/2519/pyu-r-int-thick-7-2519210.pdf?src-supplier=Digi-Key; Supplier Part Number 1: 6056592; LCSC Part Number: C107229
SW5 SW6 = TS-1185EC-C-D-B: 3mm 2mm Round Button 50mA Top3.65mm SPST 12V SMD Tactile Switches; Manufacturer: XKB; Manufacturer Part Number: TS-1185EC-C-D-B; Footprint: Custom; ComponentLink1Description: LCSC; ComponentLink1URL: https://lcsc.com/product-detail/Tactile-Switches_XKB-Connectivity-TS-1185EC-C-D-B_C318893.html; LCSC Part Number: C318893